# Altium schematic sheet Switch_Control.SchDoc
size A4
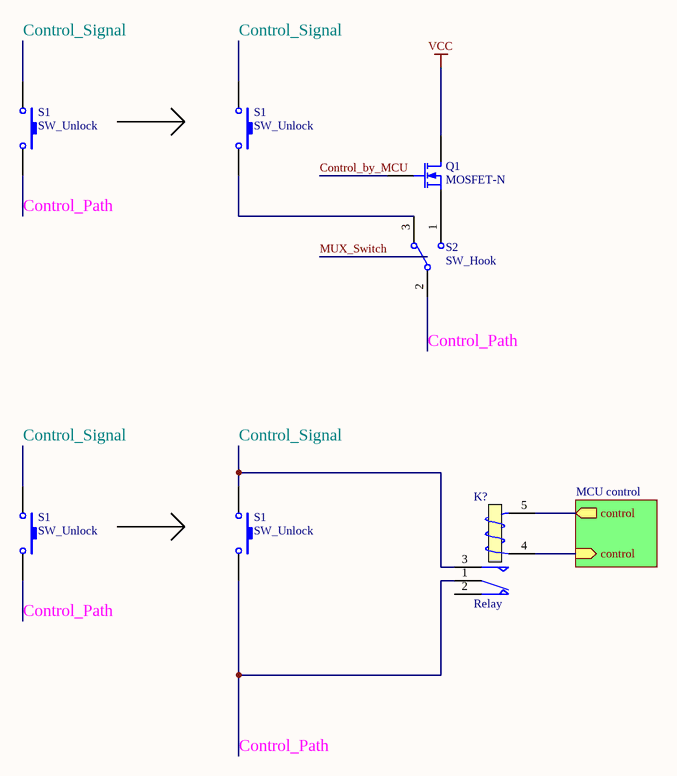
[diagram p0: Switch_Control.SchDoc]

## Parts
(Parts that share a designator on the sheet are numbered #1, #2 ... from top to bottom, then left to right.)
K?  Relay  [MODULE5B]
Q1  MOSFET-N  [E3]
S1#1  SW_Unlock  [SPST-2]
S1#2  SW_Unlock  [SPST-2]
S1#3  SW_Unlock  [SPST-2]
S1#4  SW_Unlock  [SPST-2]
S2  SW_Hook  [TL36WW15050]

## Sub-sheets
MCU control = File Name: control (out), control (in)

## Nets
VCC: Q1.1(D)
Control_by_MCU: Q1.2(G)
Control_Path: K?.1(COM) S1#1.2 S1#3.2 S1#4.2 S2.2
Control_Signal: K?.3(NO) S1#1.1 S1#2.1 S1#3.1 S1#4.1
NetK?_4: K?.4(T1) ; sheet MCU control/control
NetK?_5: K?.5(T2) ; sheet MCU control/control
NetQ1_3: Q1.3(S) S2.1
NetS1#2_2: S1#2.2 S2.3

Not connected (* = marked no-connect by the designer): K? 2(NC)

## Library data of the parts
K? = Relay: SPDT Relay; Published: 8-Jun-2000; LatestRevisionDate: 17-Jul-2002; LatestRevisionNote: Re-released for DXP Platform.; PackageReference: MODULE5B; Publisher: Altium Limited
Q1 = MOSFET-N: N-Channel MOSFET; Published: 8-Jun-2000; LatestRevisionDate: 17-Jul-2002; LatestRevisionNote: Re-released for DXP Platform.; PackageVersion: 1995/1996; PackageReference: E3; Publisher: Altium Limited; PackageDescription: TO, Flat Index; 3 In-Line, Axial Leads; Body Dia. 4.6mm; Lead Dia. 0.5 mm (max)
S1#1-S1#4 = SW-PB: Switch; Published: 24-Mar-1999; LatestRevisionDate: 17-Jul-2002; LatestRevisionNote: Re-released for DXP Platform.; PackageReference: SPST-2; Publisher: Altium Limited; PackageDescription: Switch; 2 Leads
S2 = SW-SPDT: SPDT Subminiature Toggle Switch, Right Angle Mounting, Vertical Actuation; Published: 24-Mar-1999; LatestRevisionDate: 17-Dec-2003; LatestRevisionNote: Schematic revised, PCB Footprint replaced.; DatasheetVersion: 05-Dec-2000; PackageReference: TL36WW15050; Publisher: Altium Limited; PackageDescription: Switch; 4 Leads; ComponentLink1Description: Manufacturer Link; ComponentLink1URL: http://www.apem.com